# EAGLE design DMTV_SD (EAGLE 9.5.1)

## Sheet 1 of 4
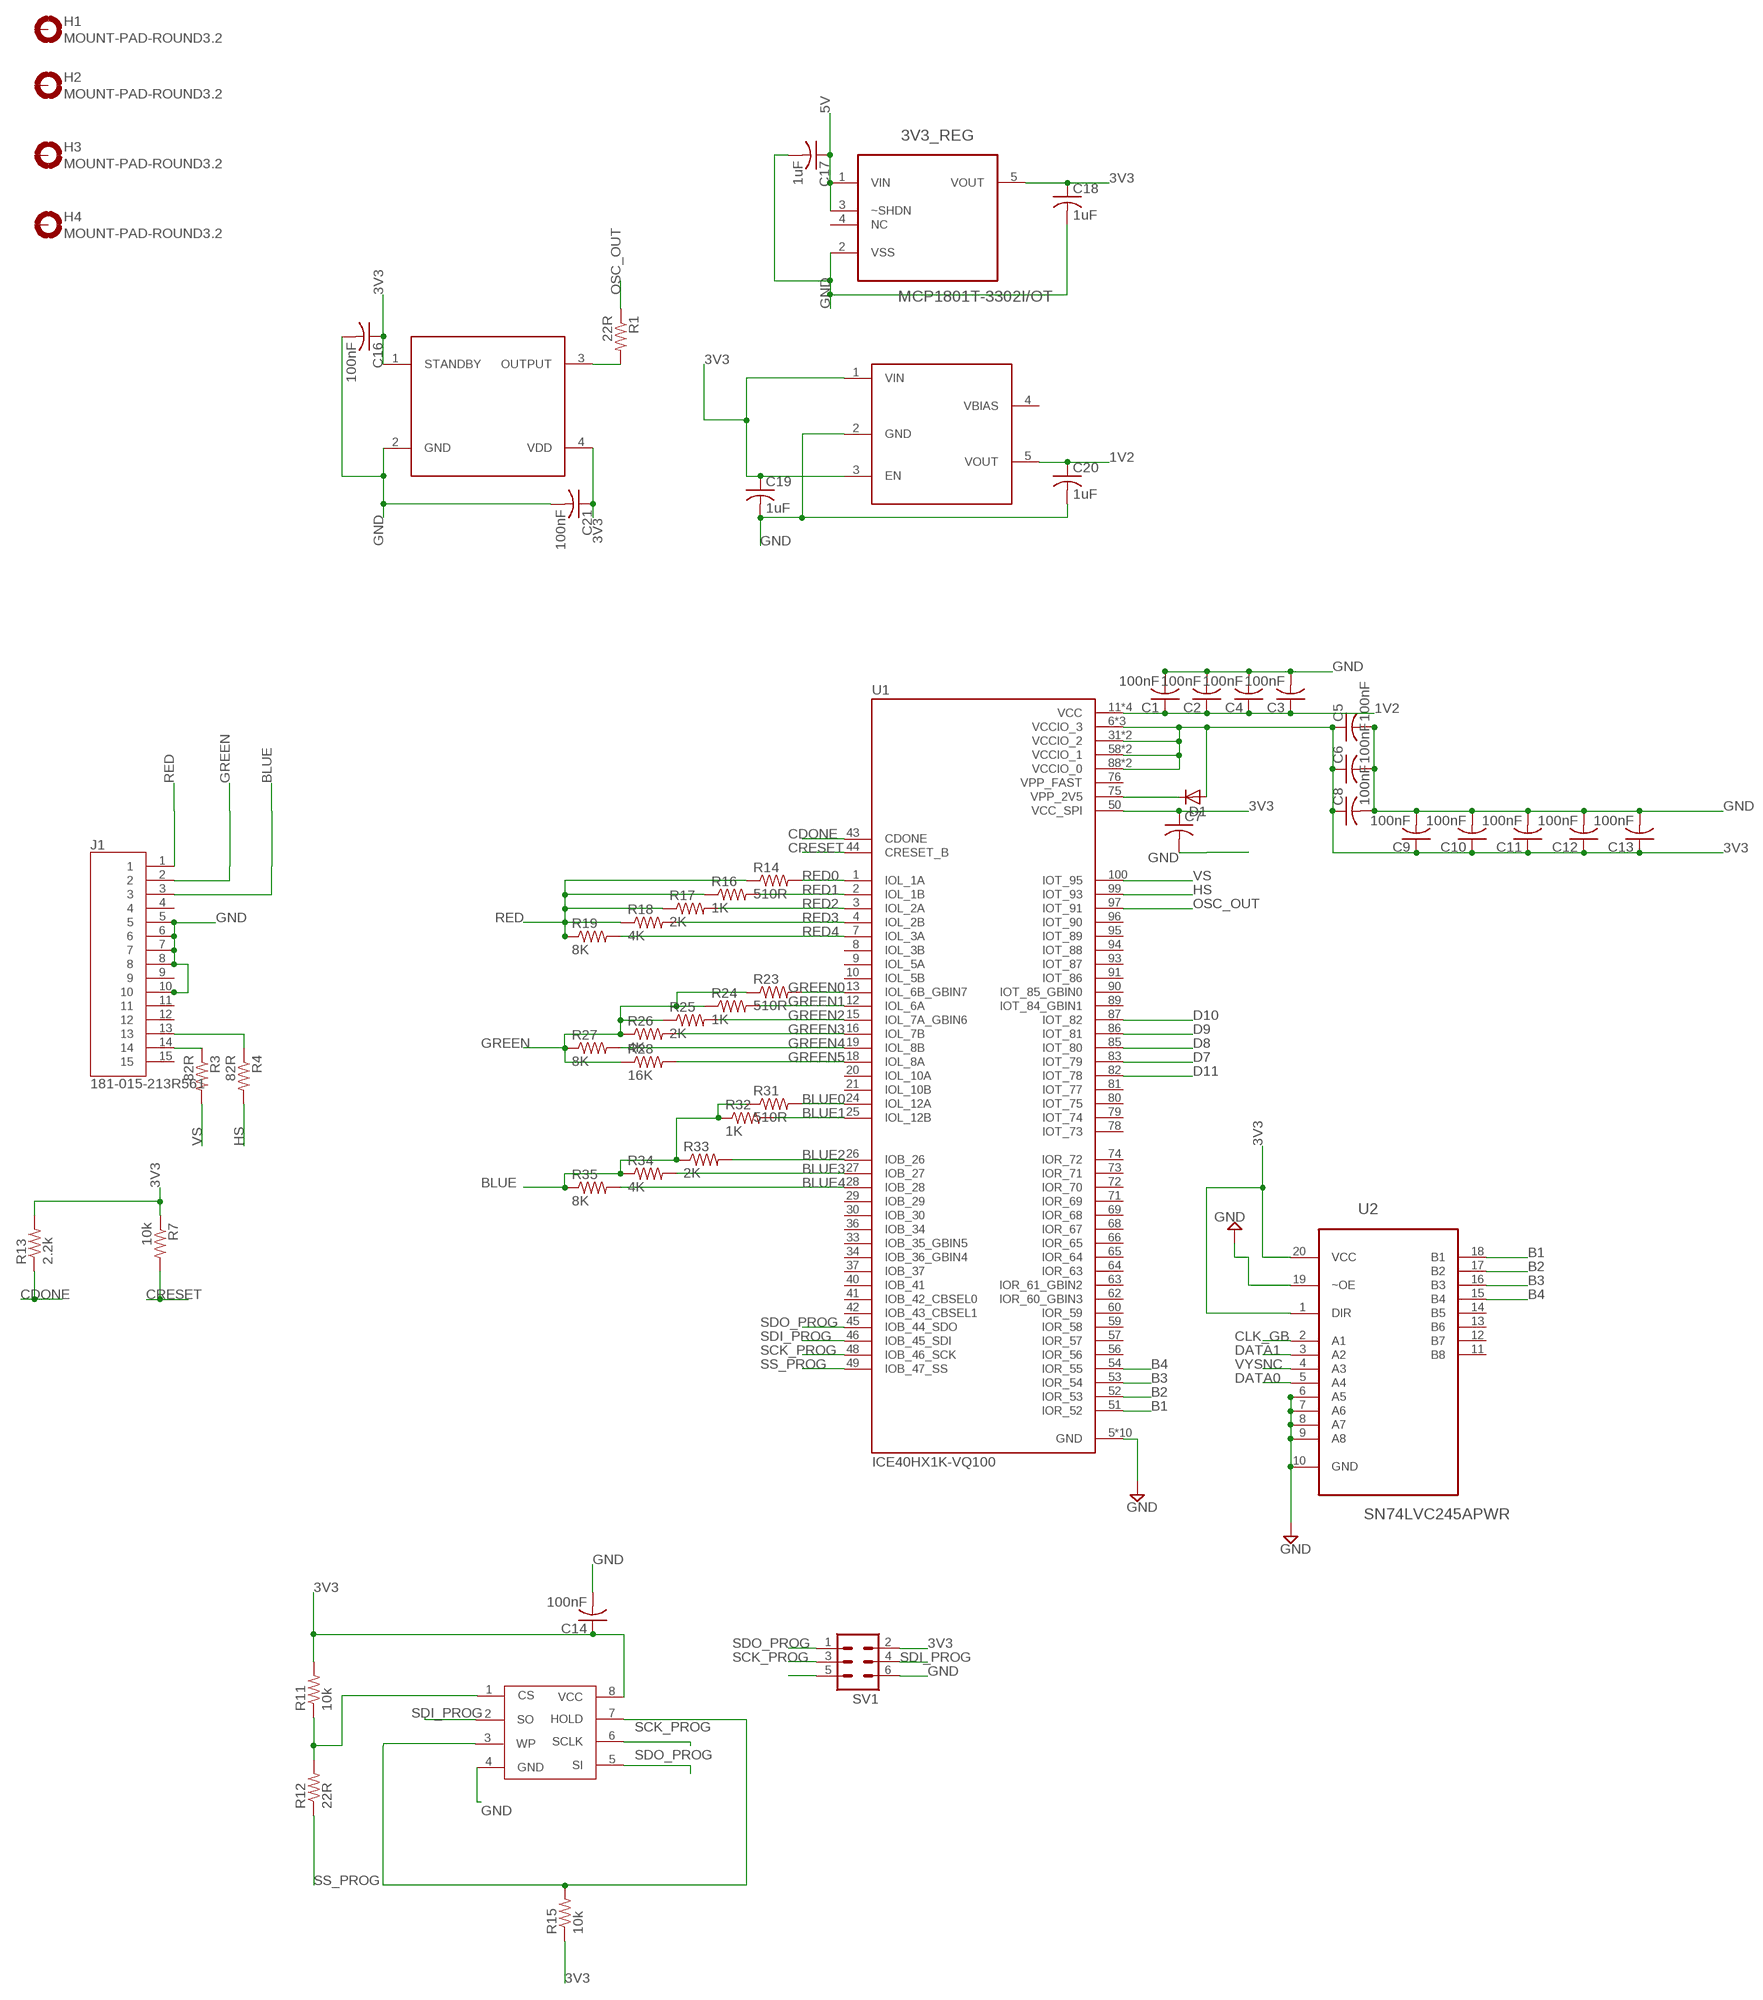
[diagram p0: schematic, sheet 1]

### Parts
3V3_REG  MCP1801T-3302I/OT  [SOT95P270X145-5N]
C1  100nF  C-USC0603  [C0603]
C2  100nF  C-USC0603  [C0603]
C3  100nF  C-USC0603  [C0603]
C4  100nF  C-USC0603  [C0603]
C5  100nF  C-USC0603  [C0603]
C6  100nF  C-USC0603  [C0603]
C7  C-USC0603  [C0603]
C8  100nF  C-USC0603  [C0603]
C9  100nF  C-USC0603  [C0603]
C10  100nF  C-USC0603  [C0603]
C11  100nF  C-USC0603  [C0603]
C12  100nF  C-USC0603  [C0603]
C13  100nF  C-USC0603  [C0603]
C14  100nF  C-USC0603  [C0603]
C16  100nF  C-USC0603  [C0603]
C17  1uF  C-USC0805  [C0805]
C18  1uF  C-USC0805  [C0805]
C19  1uF  C-USC0805  [C0805]
C20  1uF  C-USC0805  [C0805]
C21  100nF  C-USC0603  [C0603]
D1  D-SOD123  [SOD123]
H1  MOUNT-PAD-ROUND3.2  [3,2-PAD]
H2  MOUNT-PAD-ROUND3.2  [3,2-PAD]
H3  MOUNT-PAD-ROUND3.2  [3,2-PAD]
H4  MOUNT-PAD-ROUND3.2  [3,2-PAD]
J1  181-015-213R561  [NORCOMP_181-015-213R561]
R1  22R  R-US_R0603  [R0603]
R3  82R  R-US_R0603  [R0603]
R4  82R  R-US_R0603  [R0603]
R7  10k  R-US_R0603  [R0603]
R11  10k  R-US_R0603  [R0603]
R12  22R  R-US_R0603  [R0603]
R13  2.2k  R-US_R0603  [R0603]
R14  510R  R-US_R0603  [R0603]
R15  10k  R-US_R0603  [R0603]
R16  1K  R-US_R0603  [R0603]
R17  2K  R-US_R0603  [R0603]
R18  4K  R-US_R0603  [R0603]
R19  8K  R-US_R0603  [R0603]
R23  510R  R-US_R0603  [R0603]
R24  1K  R-US_R0603  [R0603]
R25  2K  R-US_R0603  [R0603]
R26  4K  R-US_R0603  [R0603]
R27  8K  R-US_R0603  [R0603]
R28  16K  R-US_R0603  [R0603]
R31  510R  R-US_R0603  [R0603]
R32  1K  R-US_R0603  [R0603]
R33  2K  R-US_R0603  [R0603]
R34  4K  R-US_R0603  [R0603]
R35  8K  R-US_R0603  [R0603]
SV1  MA03-2  [MA03-2]
U1  ICE40HX1K-VQ100  [QFP50P1600X1600X120-100N]
U2  SN74LVC245APWR  [SOP65P640X120-20N]
U$1  SIT8008BI-13-18E-25.175000G  XTAL_ASDM1-25.000MHZ-LC-T  [XTAL_ASDM1-25.000MHZ-LC-T]
U$2  TLV70012DDCR  SOT95P280X100-5N  [SOT95P280X100-5N]
U$5  MX25L1006EMI-10G  [SOIC-8]

### Nets
1V2: C1.1 C2.1 C3.1 C4.1 C20.1 U1.11(VCC) U1.35(VCC) U1.61(VCC) U1.77(VCC) U$2.5(VOUT)
3V3: 3V3_REG.5(VOUT) C5.1 C6.1 C7.1 C8.1 C9.1 C10.1 C11.1 C12.1 C13.1 C14.1 C16.1 C18.1 C19.1 C21.1 D1.2(A) R7.1 R11.2 R13.2 R15.1 SV1.2 U1.6(VCCIO_3) U1.14(VCCIO_3) U1.22(VCCIO_3) U1.31(VCCIO_2) U1.38(VCCIO_2) U1.50(VCC_SPI) U1.58(VCCIO_1) U1.67(VCCIO_1) U1.88(VCCIO_0) U1.92(VCCIO_0) U2.1(DIR) U2.20(VCC) U$1.1(STANDBY) U$1.4(VDD) U$2.1(VIN) U$2.3(EN) U$5.8(VCC)
5V: 3V3_REG.1(VIN) 3V3_REG.3(~SHDN) C17.1 ; also sheet 2,4
B1: U1.51(IOR_52) U2.18(B1)
B2: U1.52(IOR_53) U2.17(B2)
B3: U1.53(IOR_54) U2.16(B3)
B4: U1.54(IOR_55) U2.15(B4)
BLUE: J1.3 R31.1 R32.1 R33.1 R34.1 R35.1
BLUE0: R31.2 U1.24(IOL_12A)
BLUE1: R32.2 U1.25(IOL_12B)
BLUE2: R33.2 U1.26(IOB_26)
BLUE3: R34.2 U1.27(IOB_27)
BLUE4: R35.2 U1.28(IOB_28)
CDONE: R13.1 U1.43(CDONE)
CLK_GB: U2.2(A1) ; also sheet 4
CRESET: R7.2 U1.44(CRESET_B)
D7: U1.83(IOT_79) ; also sheet 2
D8: U1.85(IOT_80) ; also sheet 2
D9: U1.86(IOT_81) ; also sheet 2
D10: U1.87(IOT_82) ; also sheet 2
D11: U1.82(IOT_78) ; also sheet 2
DATA0: U2.5(A4) ; also sheet 4
DATA1: U2.3(A2) ; also sheet 4
GND: 3V3_REG.2(VSS) C1.2 C2.2 C3.2 C4.2 C5.2 C6.2 C7.2 C8.2 C9.2 C10.2 C11.2 C12.2 C13.2 C14.2 C16.2 C17.2 C18.2 C19.2 C20.2 C21.2 J1.5 J1.6 J1.7 J1.8 J1.10 SV1.6 U1.5(GND) U1.17(GND) U1.23(GND) U1.32(GND) U1.39(GND) U1.47(GND) U1.55(GND) U1.70(GND) U1.84(GND) U1.98(GND) U2.6(A5) U2.7(A6) U2.8(A7) U2.9(A8) U2.10(GND) U2.19(~OE) U$1.2(GND) U$2.2(GND) U$5.4(GND) ; also sheet 2,3,4
GREEN: J1.2 R23.1 R24.1 R25.1 R26.1 R27.1 R28.1
GREEN0: R23.2 U1.13(IOL_6B_GBIN7)
GREEN1: R24.2 U1.12(IOL_6A)
GREEN2: R25.2 U1.15(IOL_7A_GBIN6)
GREEN3: R26.2 U1.16(IOL_7B)
GREEN4: R27.2 U1.19(IOL_8B)
GREEN5: R28.2 U1.18(IOL_8A)
HS: R4.2 U1.99(IOT_93)
N$2: R1.2 U$1.3(OUTPUT)
N$6: J1.14 R3.1
N$7: D1.1(C) U1.75(VPP_2V5)
N$8: R11.1 R12.2 U$5.1(CS)
N$9: J1.13 R4.1
N$13: SV1.5
N$15: R15.2 U$5.3(WP) U$5.7(HOLD)
OSC_OUT: R1.1 U1.97(IOT_91)
RED: J1.1 R14.1 R16.1 R17.1 R18.1 R19.1
RED0: R14.2 U1.1(IOL_1A)
RED1: R16.2 U1.2(IOL_1B)
RED2: R17.2 U1.3(IOL_2A)
RED3: R18.2 U1.4(IOL_2B)
RED4: R19.2 U1.7(IOL_3A)
SCK_PROG: SV1.3 U1.48(IOB_46_SCK) U$5.6(SCLK)
SDI_PROG: SV1.4 U1.46(IOB_45_SDI) U$5.2(SO)
SDO_PROG: SV1.1 U1.45(IOB_44_SDO) U$5.5(SI)
SS_PROG: R12.1 U1.49(IOB_47_SS)
VS: R3.2 U1.100(IOT_95)
VYSNC: U2.4(A3) ; also sheet 4
Unconnected: 3V3_REG.4(NC) H1.B3,2(MOUNT) H2.B3,2(MOUNT) H3.B3,2(MOUNT) H4.B3,2(MOUNT) J1.4 J1.9 J1.11 J1.12 J1.15 U1.8(IOL_3B) U1.9(IOL_5A) U1.10(IOL_5B) U1.20(IOL_10A) U1.21(IOL_10B) U1.29(IOB_29) U1.30(IOB_30) U1.33(IOB_35_GBIN5) U1.34(IOB_36_GBIN4) U1.36(IOB_34) U1.37(IOB_37) U1.40(IOB_41) U1.41(IOB_42_CBSEL0) U1.42(IOB_43_CBSEL1) U1.56(IOR_56) U1.57(IOR_57) U1.59(IOR_58) U1.60(IOR_59) U1.62(IOR_60_GBIN3) U1.63(IOR_61_GBIN2) U1.64(IOR_63) U1.65(IOR_64) U1.66(IOR_65) U1.68(IOR_67) U1.69(IOR_68) U1.71(IOR_69) U1.72(IOR_70) U1.73(IOR_71) U1.74(IOR_72) U1.78(IOT_73) U1.79(IOT_74) U1.80(IOT_75) U1.81(IOT_77) U1.89(IOT_84_GBIN1) U1.90(IOT_85_GBIN0) U1.91(IOT_86) U1.93(IOT_87) U1.94(IOT_88) U1.95(IOT_89) U1.96(IOT_90) U2.11(B8) U2.12(B7) U2.13(B6) U2.14(B5) U$2.4(VBIAS)

## Sheet 2 of 4
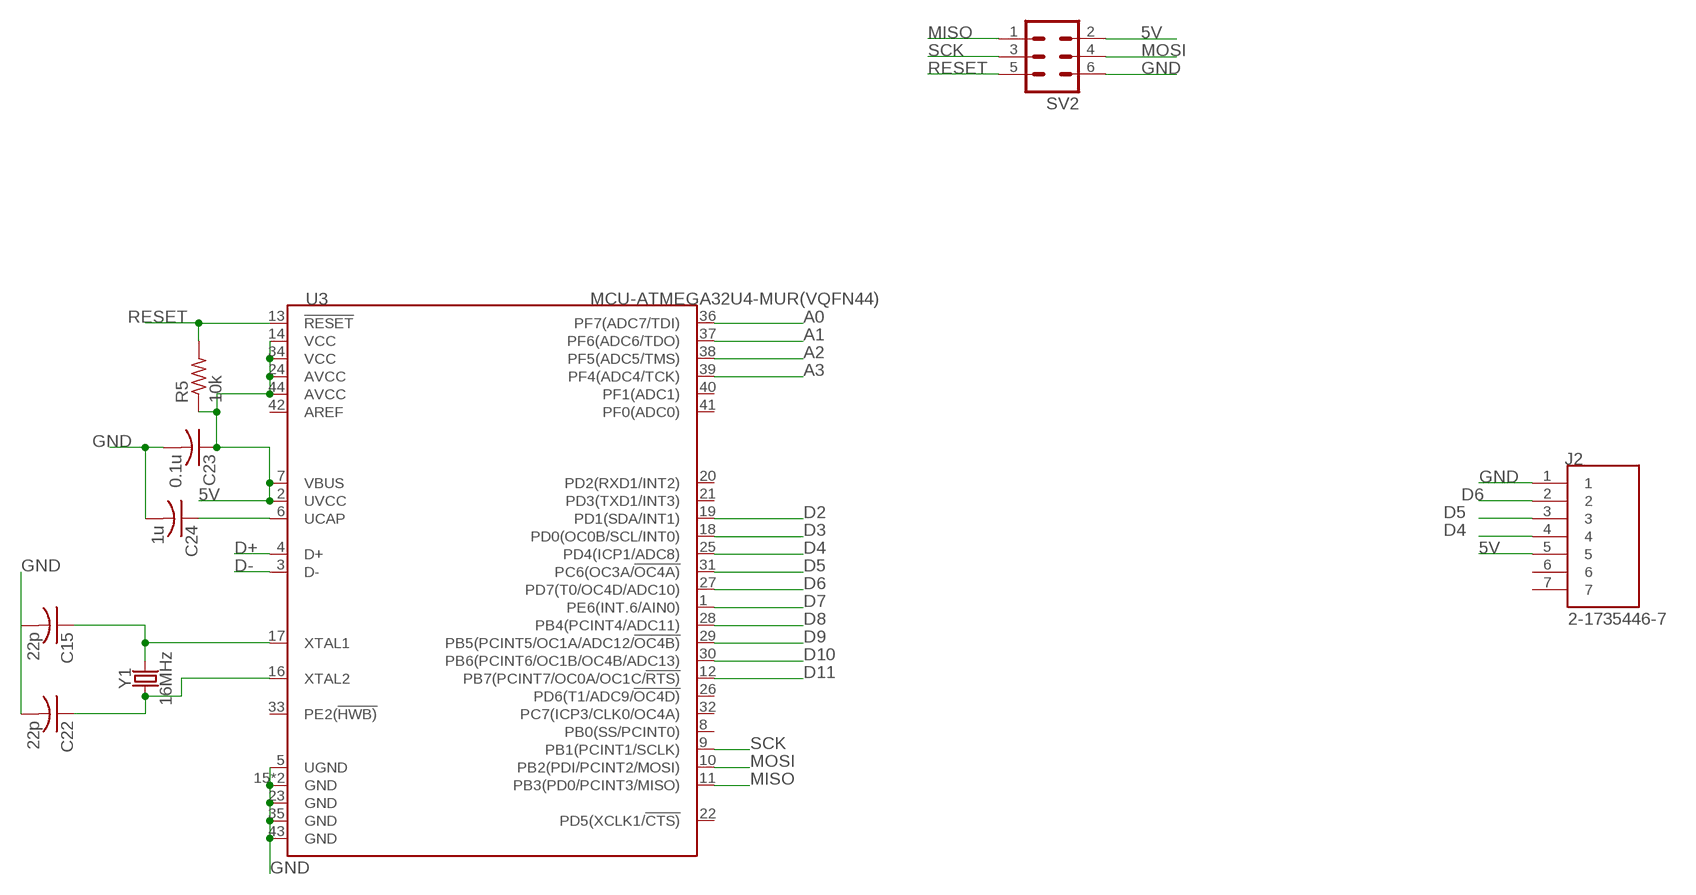
[diagram p1: schematic, sheet 2]

### Parts
C15  22p  C-USC0805  [C0805]
C22  22p  C-USC0805  [C0805]
C23  0.1u  C-USC0805  [C0805]
C24  1u  C-USC0805  [C0805]
J2  2-1735446-7  [TE_2-1735446-7]
R5  10k  R-US_R0805  [R0805]
SV2  MA03-2  [MA03-2]
U3  MCU-ATMEGA32U4-MUR(VQFN44)  [QFN44G-0.5-7X7MM]
Y1  16MHz  CRYSTAL-16MHZSMD-5X3.2  [CRYSTAL-SMD-5X3.2-4PAD]

### Nets
5V: C23.1 J2.5 R5.1 SV2.2 U3.2(UVCC) U3.7(VBUS) U3.14(VCC) U3.24(AVCC) U3.34(VCC) U3.44(AVCC) ; also sheet 1,4
A0: U3.36(PF7(ADC7/TDI)) ; also sheet 4
A1: U3.37(PF6(ADC6/TDO)) ; also sheet 4
A2: U3.38(PF5(ADC5/TMS)) ; also sheet 4
A3: U3.39(PF4(ADC4/TCK)) ; also sheet 4
D2: U3.19(PD1(SDA/INT1)) ; also sheet 4
D3: U3.18(PD0(OC0B/SCL/INT0)) ; also sheet 4
D4: J2.4 U3.25(PD4(ICP1/ADC8))
D5: J2.3 U3.31(PC6(OC3A/!OC4A))
D6: J2.2 U3.27(PD7(T0/OC4D/ADC10))
D7: U3.1(PE6(INT.6/AIN0)) ; also sheet 1
D8: U3.28(PB4(PCINT4/ADC11)) ; also sheet 1
D9: U3.29(PB5(PCINT5/OC1A/ADC12/!OC4B)) ; also sheet 1
D10: U3.30(PB6(PCINT6/OC1B/OC4B/ADC13)) ; also sheet 1
D11: U3.12(PB7(PCINT7/OC0A/OC1C/!RTS)) ; also sheet 1
D+: U3.4(D+)
D-: U3.3(D-)
GND: C15.2 C22.2 C23.2 C24.2 J2.1 SV2.6 U3.5(UGND) U3.15(GND) U3.23(GND) U3.35(GND) U3.43(GND) U3.TAB(GND) ; also sheet 1,3,4
MISO: SV2.1 U3.11(PB3(PD0/PCINT3/MISO))
MOSI: SV2.4 U3.10(PB2(PDI/PCINT2/MOSI))
N$1: C15.1 U3.17(XTAL1) Y1.3
N$3: C22.1 U3.16(XTAL2) Y1.1
N$4: C24.1 U3.6(UCAP)
RESET: R5.2 SV2.5 U3.13(!RESET)
SCK: SV2.3 U3.9(PB1(PCINT1/SCLK))
Unconnected: J2.6 J2.7 U3.8(PB0(SS/PCINT0)) U3.20(PD2(RXD1/INT2)) U3.21(PD3(TXD1/INT3)) U3.22(PD5(XCLK1/!CTS)) U3.26(PD6(T1/ADC9/!OC4D)) U3.32(PC7(ICP3/CLK0/OC4A)) U3.33(PE2(!HWB)) U3.40(PF1(ADC1)) U3.41(PF0(ADC0)) U3.42(AREF)

## Sheet 3 of 4
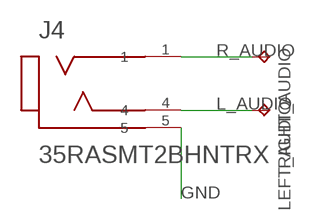
[diagram p2: schematic, sheet 3]

### Parts
J4  35RASMT2BHNTRX  [SWITCHCRAFT_35RASMT2BHNTRX]
LEFT_AUDIO  TPB2,54  [B2,54]
RIGHT_AUDIO  TPB2,54  [B2,54]

### Nets
GND: J4.5 ; also sheet 1,2,4
L_AUDIO: J4.4 LEFT_AUDIO.TP
R_AUDIO: J4.1 RIGHT_AUDIO.TP

## Sheet 4 of 4
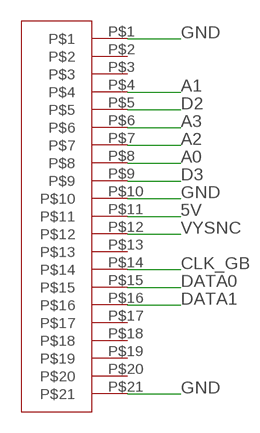
[diagram p3: schematic, sheet 4]

### Parts
U$6  52808-21700520452145  [0520452145]

### Nets
5V: U$6.P$11 ; also sheet 1,2
A0: U$6.P$8 ; also sheet 2
A1: U$6.P$4 ; also sheet 2
A2: U$6.P$7 ; also sheet 2
A3: U$6.P$6 ; also sheet 2
CLK_GB: U$6.P$14 ; also sheet 1
D2: U$6.P$5 ; also sheet 2
D3: U$6.P$9 ; also sheet 2
DATA0: U$6.P$15 ; also sheet 1
DATA1: U$6.P$16 ; also sheet 1
GND: U$6.P$1 U$6.P$10 U$6.P$21 ; also sheet 1,2,3
VYSNC: U$6.P$12 ; also sheet 1
Unconnected: U$6.P$2 U$6.P$3 U$6.P$13 U$6.P$17 U$6.P$18 U$6.P$19 U$6.P$20

## Power pins joined to a net without a drawn wire
VPP_FAST: U1.76(VPP_FAST)

## Library data of the parts
3V3_REG = MCP1801T-3302I_OT:MCP1801T-3302I/OT: Low Quiescent Current LDO; DESCRIPTION: Ic, Linear Regulator; Max. Input, 10v; Output, 3.3v; 150ma; Accuracy, 0.4%; Sot23-5; DIGI-KEY_PART_NUMBER: MCP1801T-3302I/OTCT-ND; DIGI-KEY_PURCHASE_URL: https://www.digikey.com/product-detail/en/microchip-technology/MCP1801T-3302I-OT/MCP1801T-3302I-OTCT-ND/1979868?utm_source=snapeda&utm_medium=aggregator&utm_campaign=symbol; MF: Microchip; MP: MCP1801T-3302I/OT; PACKAGE: SOT-23-5 Microchip
C1-C24 = rcl:C-US: CAPACITOR, American symbol; SPICEPREFIX: C
D1 = semicon-smd-ipc:D-: DIODE unfilled
H1-H4 = holes:MOUNT-PAD-ROUND: MOUNTING PAD, round
J1 = 181-015-213R561:181-015-213R561: 181 Series 15 Position Female Receptacle Right Angle D-Sub Connector; AVAILABILITY: Unavailable; DESCRIPTION: 181 Series 15 Position Female Receptacle Right Angle D-Sub Connector; MF: NorComp Inc.; MP: 181-015-213R561; PACKAGE: None; PRICE: None
J2 = 2-1735446-7_nesCont:2-1735446-7; AVAILABILITY: Unavailable; CENTERLINE_PITCH: 2 mm[.079 in]; COMMENT: 2-1735446-7; DESCRIPTION: 2MM PITCH HPI POST HEADER, VERTICAL, 7P; EU_ROHS_COMPLIANCE: Compliant; MF: TE Connectivity; MP: 2-1735446-7; NUMBER_OF_POSITIONS: 7; PACKAGE: None; PRICE: None; PRODUCT_TYPE: Connector; TE_PURCHASE_URL: https://www.te.com/usa-en/product-2-1735446-7.html?te_bu=Cor&te_type=disp&te_campaign=seda_glo_cor-seda-global-disp-prtnr-fy19-seda-model-bom-cta_sma-317_1&elqCampaignId=32493
J4 = 35RASMT2BHNTRX_3.5mmJack:35RASMT2BHNTRX: Conn 3.5MM Stereo Jack F 3 POS Solder RA SMD 3 Terminal 1 Port T/R; AVAILABILITY: Unavailable; DESCRIPTION: Conn 3.5MM Stereo Jack F 3 POS Solder RA SMD 3 Terminal 1 Port T/R; MF: Switchcraft; MP: 35RASMT2BHNTRX; PACKAGE: None; PRICE: None
LEFT_AUDIO RIGHT_AUDIO = testpad:TP: Test pad
R1 R3 R4 R7 R14 R16-R19 R23-R28 R31-R35 = resistor:R-US_: RESISTOR, American symbol
R5 R11-R13 R15 = rcl:R-US_: RESISTOR, American symbol; SPICEPREFIX: R
SV1 SV2 = con-lstb:MA03-2: PIN HEADER; OC_FARNELL: unknown; OC_NEWARK: unknown
U1 = ICE40HX1K-VQ100:ICE40HX1K-VQ100: HX Series 1280 LUTs 95 I/O 64 kBit RAM 1.2 V Surface Mount FPGA - VQFP-100; DESCRIPTION: HX Series 1280 LUTs 95 I/O 64 kBit RAM 1.2 V Surface Mount FPGA - VQFP-100; DIGI-KEY_PART_NUMBER: 220-1567-ND; DIGI-KEY_PURCHASE_URL: https://www.digikey.com/product-detail/en/lattice-semiconductor-corporation/ICE40HX1K-VQ100/220-1567-ND/3083577?utm_source=snapeda&utm_medium=aggregator&utm_campaign=symbol; MF: Lattice Semiconductor; MP: ICE40HX1K-VQ100; PACKAGE: TQFP-100 Lattice Semiconductor
U2 = SN74LVC245APWR:SN74LVC245APWR: OCTAL BUS TRANSCEIVER WITH 3-STATE OUTPUTS; DESCRIPTION: Octal Bus Transceiver With 3-State Outputs 20-TSSOP -40 to 125; DIGI-KEY_PART_NUMBER: 296-1233-1-ND; DIGI-KEY_PURCHASE_URL: https://www.digikey.com/product-detail/en/texas-instruments/SN74LVC245APWR/296-1233-1-ND/276501?utm_source=snapeda&utm_medium=aggregator&utm_campaign=symbol; MF: Texas Instruments; MP: SN74LVC245APWR; PACKAGE: TSSOP-20 Texas Instruments
U3 = MCU-ATMEGA32U4-MUR_VQFN44_:MCU-ATMEGA32U4-MUR(VQFN44): 310010016; AVAILABILITY: Unavailable; DESCRIPTION: ATmega Series 32 KB Flash 2.5 KB SRAM 16 MHz 8-Bit Microcontroller - MLF/QFN-44; MF: Microchip; MP: ATMEGA32U4-MUR; PACKAGE: QFN-44 Microchip; PRICE: None
U$1 = XTAL_ASDM1-25.000MHZ-LC-T:XTAL_ASDM1-25.000MHZ-LC-T
U$2 = SOT95P280X100-5N:SOT95P280X100-5N
U$5 = MX25L1006EMI-10G:MX25L1006EMI-10G
U$6 = 0520452145:52808-2170
Y1 = SparkFun-Clocks (2019_02_28 07_43_24 UTC):CRYSTAL-16MHZ: 16MHz Crystal Digikey Example <http://www.digikey.com/product-search/en?keywords=535-9122-1-ND> Frequency: 16MHz Frequency Stability: ±50ppm Frequency Tolerance: ±20ppm Load Capacitance: 18pF SparkFun Products: Pro Micro -5V/16MHz <https://www.sparkfun.com/products/12640> SparkFun Serial Enabled LCD Kit <https://www.sparkfun.com/products/10097>; PROD_ID: XTAL-08218; SF_ID: COM-00094

## Board
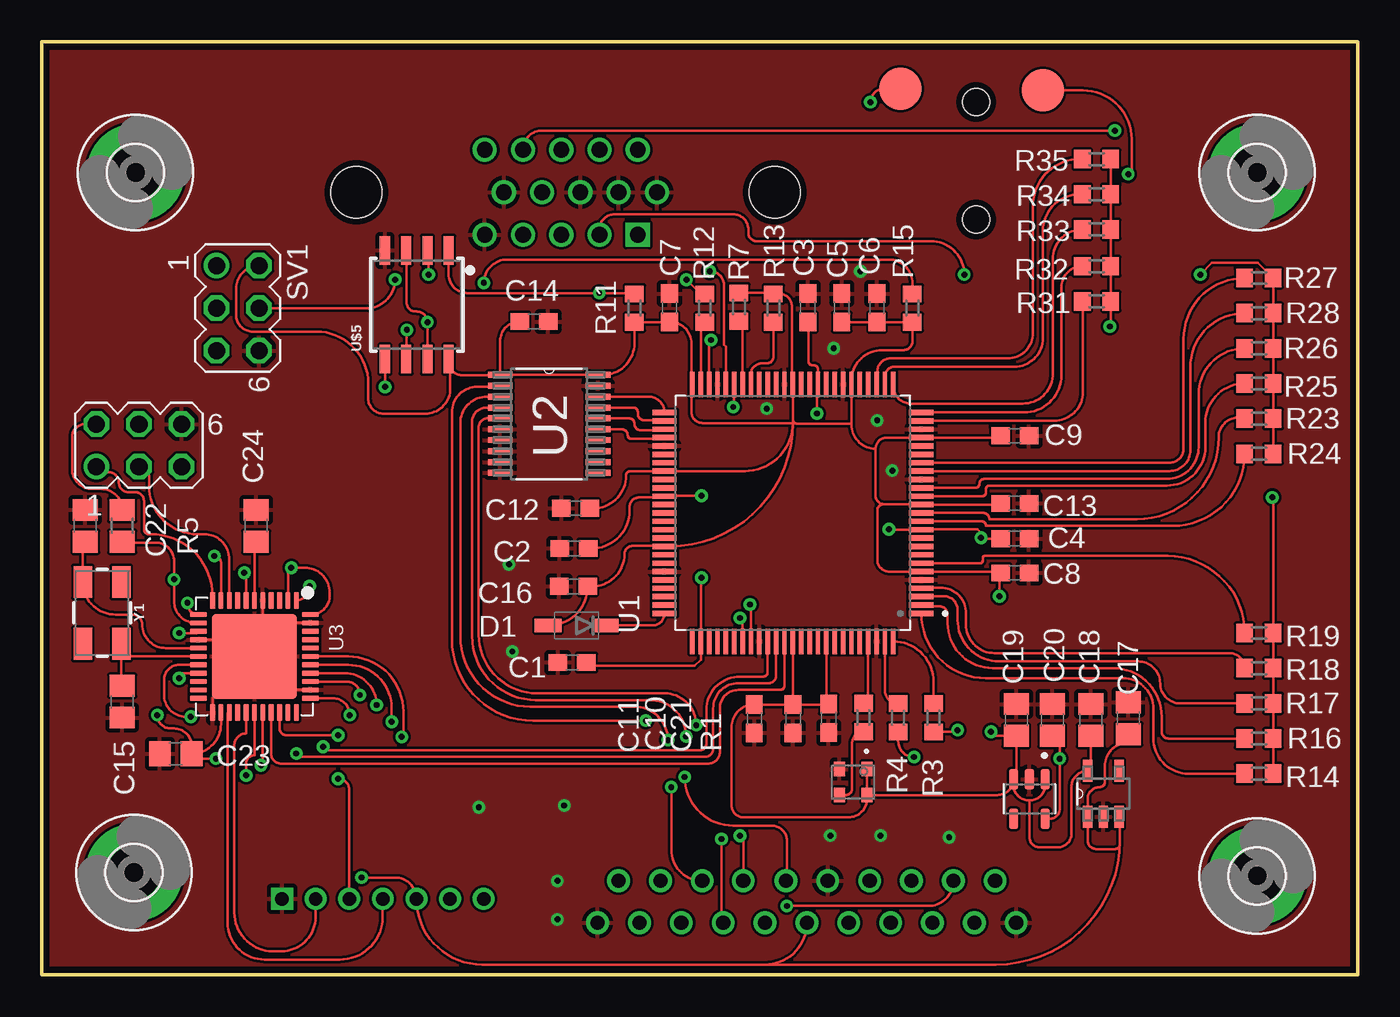
[diagram p4: board, top side]
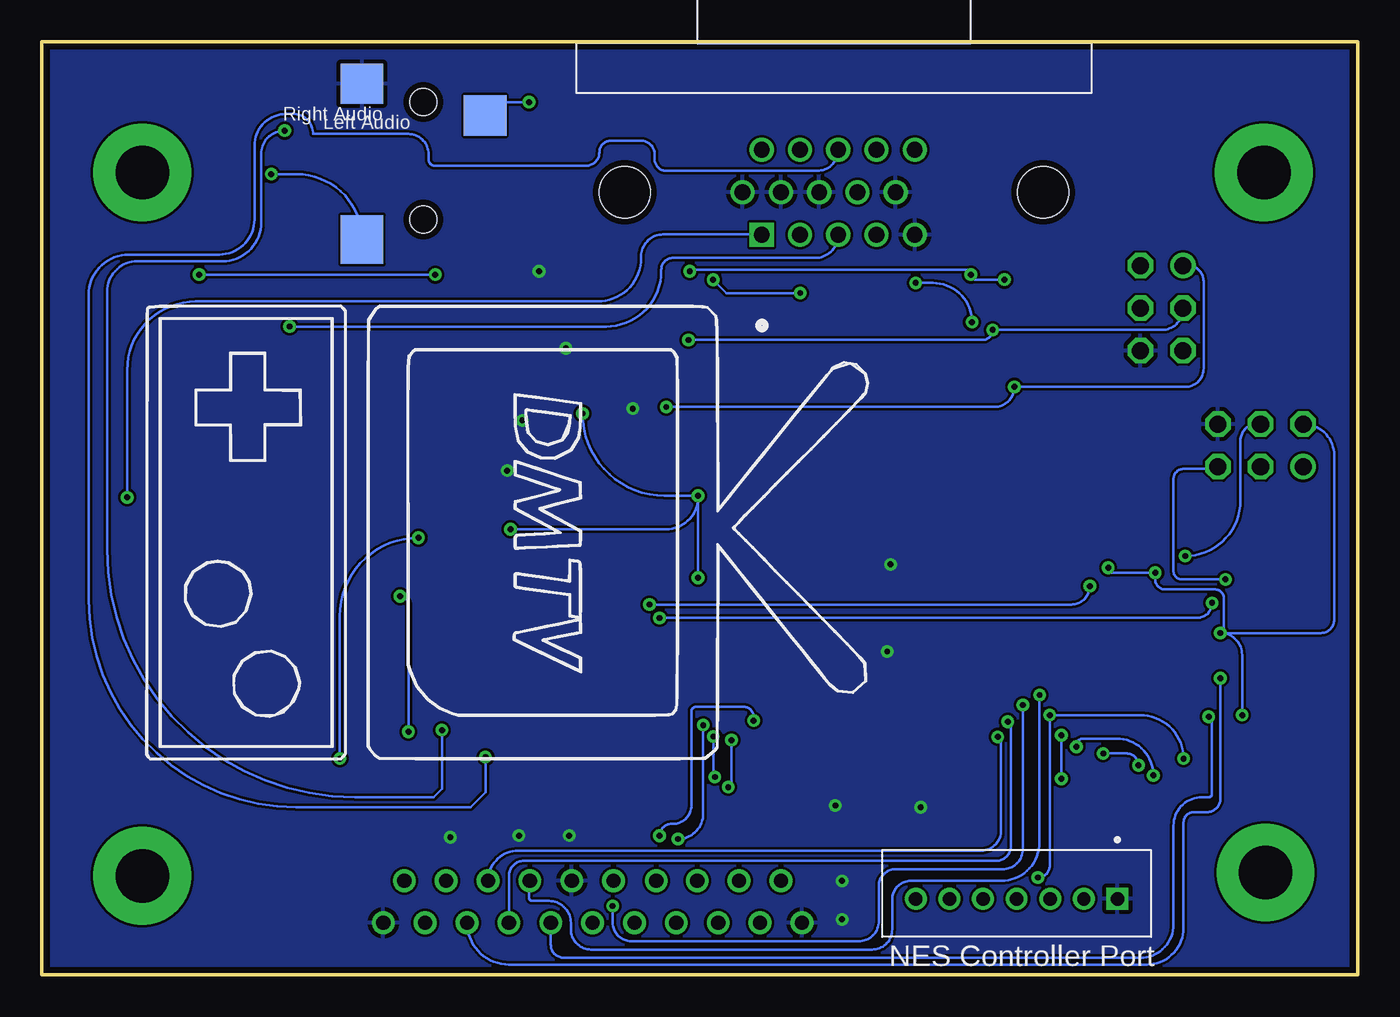
[diagram p5: board, bottom side, seen from below]

Size 78.6 x 55.7 mm. Coordinates in mm from the lower left corner, seen from the top.
Outline: 0,0 0,55.7 78.6,55.7 78.6,0 0,0
Copper layers (1*16): Top 0.035mm / dielectric 1.5mm / Bottom 0.035mm
Design rules "default *": minimum track width 6mil, minimum drill 0.35mm, track to track 6mil, track to pad 6mil, pad to pad 6mil, via to via 6mil, smd to smd 6mil, copper to edge 15mil, drill to drill 6mil, minimum pad ring 10mil, minimum via ring 8mil, stop-mask expansion 4mil, vias tented up to drill 36mil, thermal gap 10mil

### Footprints (pad centres in the part's own frame; a part is rotated, then mirrored left to right if it is on the bottom)
SOT95P270X145-5N = smd 1.321 x 0.559: 1 -1.372,0.94; 2 -1.372,0; 3 -1.372,-0.94; 4 1.372,-0.94; 5 1.372,0.94
C0603 = smd 1.1 x 1: 1 -0.85,0; 2 0.85,0
C0805 = smd 1.3 x 1.5: 1 -0.95,0; 2 0.95,0
SOD123 = smd 1.6 x 0.8: 1 -1.7,0; 2 1.7,0
3,2-PAD = drill 3.2 pad 5.842: B3,2 0,0
NORCOMP_181-015-213R561 = drill 0.94 square: 1 4.318,2.54 | drill 0.94: 2 2.032,2.54; 3 -0.254,2.54; 4 -2.54,2.54; 5 -4.826,2.54; 6 5.461,0; 7 3.175,0; 8 0.889,0; 9 -1.397,0; 10 -3.683,0; 11 4.318,-2.54; 12 2.032,-2.54; 13 -0.254,-2.54; 14 -2.54,-2.54; 15 -4.826,-2.54 | hole 3.048: 12.497,0; -12.497,0
TE_2-1735446-7 = drill 0.8 square: 1 6.02,0 | drill 0.8: 2 4.013,0; 3 2.007,0; 4 0,0; 5 -2.007,0; 6 -4.013,0; 7 -6.02,0
SWITCHCRAFT_35RASMT2BHNTRX = smd 2.4 x 2.55: 1 -2.7,3.675; 5 -4.6,-3.675 | smd 2.9 x 2.55: 4 4.7,-3.675 | hole 1.6: -3.5,0; 3.5,0
B2,54 = smd 2.54 x 2.54: TP 0,0
R0603 = smd 1 x 1.1: 1 -0.85,0; 2 0.85,0
R0805 = smd 1.3 x 1.5: 1 -0.95,0; 2 0.95,0
MA03-2 = drill 1.016: 1 -2.54,-1.27 | drill 1.016 octagon: 2 -2.54,1.27; 3 0,-1.27; 4 0,1.27; 5 2.54,-1.27; 6 2.54,1.27
QFP50P1600X1600X120-100N = smd 1.47 x 0.28: 1 -7.67,6; 2 -7.67,5.5; 3 -7.67,5; 4 -7.67,4.5; 5 -7.67,4; 6 -7.67,3.5; 7 -7.67,3; 8 -7.67,2.5; 9 -7.67,2; 10 -7.67,1.5; 11 -7.67,1; 12 -7.67,0.5; 13 -7.67,0; 14 -7.67,-0.5; 15 -7.67,-1; 16 -7.67,-1.5; 17 -7.67,-2; 18 -7.67,-2.5; 19 -7.67,-3; 20 -7.67,-3.5; 21 -7.67,-4; 22 -7.67,-4.5; 23 -7.67,-5; 24 -7.67,-5.5; 25 -7.67,-6; 51 7.67,-6; 52 7.67,-5.5; 53 7.67,-5; 54 7.67,-4.5; 55 7.67,-4; 56 7.67,-3.5; 57 7.67,-3; 58 7.67,-2.5; 59 7.67,-2; 60 7.67,-1.5; 61 7.67,-1; 62 7.67,-0.5; 63 7.67,0; 64 7.67,0.5; 65 7.67,1; 66 7.67,1.5; 67 7.67,2; 68 7.67,2.5; 69 7.67,3; 70 7.67,3.5; 71 7.67,4; 72 7.67,4.5; 73 7.67,5; 74 7.67,5.5; 75 7.67,6 | smd 0.28 x 1.47: 26 -6,-7.67; 27 -5.5,-7.67; 28 -5,-7.67; 29 -4.5,-7.67; 30 -4,-7.67; 31 -3.5,-7.67; 32 -3,-7.67; 33 -2.5,-7.67; 34 -2,-7.67; 35 -1.5,-7.67; 36 -1,-7.67; 37 -0.5,-7.67; 38 0,-7.67; 39 0.5,-7.67; 40 1,-7.67; 41 1.5,-7.67; 42 2,-7.67; 43 2.5,-7.67; 44 3,-7.67; 45 3.5,-7.67; 46 4,-7.67; 47 4.5,-7.67; 48 5,-7.67; 49 5.5,-7.67; 50 6,-7.67; 76 6,7.67; 77 5.5,7.67; 78 5,7.67; 79 4.5,7.67; 80 4,7.67; 81 3.5,7.67; 82 3,7.67; 83 2.5,7.67; 84 2,7.67; 85 1.5,7.67; 86 1,7.67; 87 0.5,7.67; 88 0,7.67; 89 -0.5,7.67; 90 -1,7.67; 91 -1.5,7.67; 92 -2,7.67; 93 -2.5,7.67; 94 -3,7.67; 95 -3.5,7.67; 96 -4,7.67; 97 -4.5,7.67; 98 -5,7.67; 99 -5.5,7.67; 100 -6,7.67
SOP65P640X120-20N = smd 1.473 x 0.356: 1 -2.921,2.921; 2 -2.921,2.286; 3 -2.921,1.626; 4 -2.921,0.965; 5 -2.921,0.33; 6 -2.921,-0.33; 7 -2.921,-0.965; 8 -2.921,-1.626; 9 -2.921,-2.286; 10 -2.921,-2.921; 11 2.921,-2.921; 12 2.921,-2.286; 13 2.921,-1.626; 14 2.921,-0.965; 15 2.921,-0.33; 16 2.921,0.33; 17 2.921,0.965; 18 2.921,1.626; 19 2.921,2.286; 20 2.921,2.921
QFN44G-0.5-7X7MM = smd 1 x 0.3: 1 -3.35,2.5; 2 -3.35,2; 3 -3.35,1.5; 4 -3.35,1; 5 -3.35,0.5; 6 -3.35,0; 7 -3.35,-0.5; 8 -3.35,-1; 9 -3.35,-1.5; 10 -3.35,-2; 11 -3.35,-2.5; 23 3.35,-2.5; 24 3.35,-2; 25 3.35,-1.5; 26 3.35,-1; 27 3.35,-0.5; 28 3.35,0; 29 3.35,0.5; 30 3.35,1; 31 3.35,1.5; 32 3.35,2; 33 3.35,2.5 | smd 0.3 x 1: 12 -2.5,-3.35; 13 -2,-3.35; 14 -1.5,-3.35; 15 -1,-3.35; 16 -0.5,-3.35; 17 0,-3.35; 18 0.5,-3.35; 19 1,-3.35; 20 1.5,-3.35; 21 2,-3.35; 22 2.5,-3.35; 34 2.5,3.35; 35 2,3.35; 36 1.5,3.35; 37 1,3.35; 38 0.5,3.35; 39 0,3.35; 40 -0.5,3.35; 41 -1,3.35; 42 -1.5,3.35; 43 -2,3.35; 44 -2.5,3.35 | smd 5.08 x 5.08: TAB 0,0
XTAL_ASDM1-25.000MHZ-LC-T = smd 0.85 x 0.65: 1 -0.775,0.825; 2 -0.775,-0.825; 3 0.775,-0.825; 4 0.775,0.825
SOT95P280X100-5N = smd 1.24 x 0.55: 1 -1.185,0.95; 2 -1.185,0; 3 -1.185,-0.95; 4 1.185,-0.95; 5 1.185,0.95
SOIC-8 = smd 0.61 x 1.702: 1 -1.905,-3.251; 2 -0.635,-3.251; 3 0.635,-3.251; 4 1.905,-3.251; 5 1.905,3.251; 6 0.635,3.251; 7 -0.635,3.251; 8 -1.905,3.251
0520452145 = drill 0.85: P$1 0,0; P$2 1.25,2.5; P$3 2.5,0; P$4 3.75,2.5; P$5 5,0; P$6 6.25,2.5; P$7 7.5,0; P$8 8.75,2.5; P$9 10,0; P$10 11.25,2.5; P$11 12.5,0; P$12 13.75,2.5; P$13 15,0; P$14 16.3,2.5; P$15 17.5,0; P$16 18.75,2.5; P$17 20,0; P$18 21.25,2.5; P$19 22.5,0; P$20 23.75,2.5; P$21 25,0
CRYSTAL-SMD-5X3.2-4PAD = smd 1.9 x 1.1: 1 -1.85,-1.15; 2 1.85,-1.15; 3 1.85,1.15; 4 -1.85,1.15

### Placement (x,y rotation side)
3V3_REG  63.41,10.8 90 top
C1  31.68,18.64 180 top
C2  31.78,25.45 180 top
C3  45.76,39.82 90 top
C4  58.12,26.03 0 top
C5  47.78,39.82 90 top
C6  49.89,39.82 90 top
C7  37.5,39.82 90 top
C8  58.12,23.99 0 top
C9  58.12,32.18 0 top
C10  44.87,15.28 270 top
C11  42.56,15.28 270 top
C12  31.88,27.85 180 top
C13  58.12,28.14 0 top
C14  29.4,39 0 top
C15  4.8,16.3 270 top
C16  31.76,23.19 180 top
C17  64.91,15.31 90 top
C18  62.66,15.21 90 top
C19  58.21,15.21 90 top
C20  60.36,15.21 90 top
C21  47,15.3 270 top
C22  2.6,26.8 90 top
C23  8,13.2 180 top
C24  12.8,26.8 90 top
D1  31.94,20.85 180 top
H1  5.6,47.9 0 top
H2  5.5,6.1 0 top
H3  72.6,5.9 0 top
H4  72.6,47.9 0 top
J1  31.28,46.72 180 bottom
J2  20.37,4.52 0 bottom
J4  55.8,48.6 270 bottom
LEFT_AUDIO  59.8,52.8 0 top
R1  49.09,15.36 270 top
R3  53.27,15.34 90 top
R4  51.15,15.34 90 top
R5  4.8,26.8 270 top
R7  41.64,39.86 270 top
R11  35.4,39.8 270 top
R12  39.6,39.8 90 top
R13  43.7,39.8 90 top
R14  72.7,12 180 top
R15  52,39.8 90 top
R16  72.7,14.1 180 top
R17  72.7,16.2 180 top
R18  72.7,18.3 180 top
R19  72.7,20.4 180 top
R23  72.7,33.2 180 top
R24  72.7,31.1 180 top
R25  72.7,35.3 180 top
R26  72.7,37.4 180 top
R27  72.7,41.6 180 top
R28  72.7,39.5 180 top
R31  63,40.2 180 top
R32  63,42.3 180 top
R33  63,44.5 180 top
R34  63,46.6 180 top
R35  63,48.7 180 top
RIGHT_AUDIO  51.3,52.9 0 top
SV1  11.7,39.8 270 top
SV2  5.8,31.6 0 top
U1  44.86,27.57 180 top
U2  30.3,32.89 0 top
U3  12.7,19 270 top
U$1  48.46,11.5 270 top
U$2  58.99,10.49 270 top
U$4  [DMTVPLS]  72.4,40 270 bottom
U$5  22.4,40 180 top
U$6  58.2,3.1 0 bottom
Y1  3.6,21.6 270 top

### Tracks (layer width: path | path; a pad name or v marks a point on that pad's centre or on a via)
1V2  (via drill 0.35)
  Top 0.152: C4.1 56.47,26.03 arc-90 56.2,26.3 arc90 56.1,26.4 | C3.1 arc-90 45.8,38.93 45.8,36.6 arc90 46,36.4 46.1,36.4 arc-90 46.36,36.14 U1.35 arc90 46.3,35.18 v46.3,33.51 | C2.1 32.85,25.45 arc90 35.1,27.7 35.1,27.9 arc-90 35.7,28.5 37.12,28.5 arc90 U1.61 arc-90 37.22,28.6 v39.4,28.6 | C20.1 arc-90 60.8,13.82 v60.8,12.9 | v60.8,12.9 60.8,12.6 | 60.8,12.6 60.8,9.9 arc-90 60.2,9.3 U$2.5 | C1.1 32.73,18.44 39,18.44 39.36,18.8 U1.77 39.36,23.66 arc-90 v39.4,23.7 | 60.8,12.6 v60.8,12.9 | v56.1,26.09 56.1,26.4 | v50.6,26.6 arc90 50.63,26.57 U1.11 arc-90 52.56,26.6 55.9,26.6 56.1,26.4
  Bottom 0.152: v60.8,12.9 60.8,21.39 arc90 v56.1,26.09 | v39.4,23.7 39.4,28.5 | 39.4,28.5 v39.4,28.6 41.39,28.6 arc90 v46.3,33.51 | v50.6,26.6 41.3,26.6 arc-90 39.4,28.5
3V3  (via drill 0.35)
  Top 0.152: C13.1 arc-90 57.2,28.07 U1.14 arc90 52.5,28.1 50.3,28.1 | C9.1 arc-90 57.16,32.07 U1.22 50.47,32.07 arc90 49.8,31.4 | C5.1 C6.1 51.98,38.97 arc-90 R15.1 52,37.8 arc-90 51.5,37.3 50.2,37.3 arc90 48.36,35.46 U1.31 48.36,32.9 | C7.1 37.53,38.97 | 37.53,38.97 arc-90 38.8,37.7 38.8,35.3 arc90 U1.50 arc90 38.8,35.18 38.8,33.6 arc90 39.46,32.94 44.86,32.94 | R11.2 35.5,38.95 | 35.5,38.95 37.51,38.95 arc90 37.53,38.97 | C12.1 32.95,27.85 arc90 34.9,29.8 arc-90 35.17,30.07 U1.58 41.99,30.07 arc90 44.86,32.94 | C10.1 C11.1 arc90 41.2,14.77 41.2,10.1 arc90 41.9,9.4 48.2,9.4 arc90 49.29,10.48 U$1.4 | C10.1 46.98,16.13 arc90 C21.1 arc-90 46.86,16.29 U1.92 | C10.1 U1.88 arc90 U1.88 | U$1.1 U$1.4 | U$2.3 arc-90 57.09,10.72 U$1.4 | U$2.3 arc90 58.21,11.85 C19.1 56.94,14.26 arc-90 v56.7,14.5 | U$2.1 59.94,11.34 arc-90 59,10.4 | 59,10.4 arc-106 U$2.3 | C18.1 62.66,12.36 arc-90 3V3_REG.5 arc90 61.5,11.2 61.5,8.4 arc-90 60.7,7.6 59.6,7.6 arc-90 59,8.2 59,10.4 | R7.1 43.64,40.71 arc-90 R13.2 44.05,40.65 arc-90 44.8,39.9 44.8,35.3 arc90 U1.38 44.86,33.14 | D1.2 30.27,20.85 arc90 C16.1 32.89,23.19 arc90 34.8,25.1 arc-90 35.3,25.6 37.16,25.6 arc-90 U1.67 37.49,25.57 arc90 44.86,32.94 | 27.5,35.81 U2.1 27.38,37.83 arc-90 C14.1 | 27.5,35.81 U2.20 33.51,35.81 arc90 35.4,37.7 35.4,38.85 arc-90 35.5,38.95 | U$5.8 24.3,36.59 | 24.3,36.59 arc90 25.1,35.8 27.49,35.8 arc90 27.5,35.81 | SV1.2 arc90 11.6,40.97 11.6,39.4 arc90 12.6,38.4 16.4,38.4 arc-90 19.5,35.3 19.5,34.4 arc90 20.4,33.5 22.9,33.5 arc90 24.4,35 24.4,36.5 arc90 24.3,36.59 | v57.2,22.6 57.2,23.92 arc-90 C8.1 arc90 57.19,24.07 U1.6 50.63,24.07 arc-90 49.9,24.8 49.9,27.7 arc-90 50.3,28.1
  Top 0.152: 49.8,31.4 49.8,28.6 arc90 50.3,28.1 | 48.36,32.9 48.36,32.84 arc90 49.8,31.4 | 44.86,33.14 arc90 45.1,32.9 48.36,32.9 | 44.86,33.14 44.86,32.94
  Bottom 0.152: v56.7,14.5 56.7,22.1 arc-90 v57.2,22.6
5V  (via drill 0.35)
  Top 0.152: 64.4,8 64.4,7.8 arc-90 64.1,7.5 63,7.5 arc-90 62.47,8.03 3V3_REG.1 62.47,10.47 arc-90 63.2,11.2 arc90 63.5,11.5 63.5,12.45 arc-90 64.91,13.86 C17.1 | 64.4,8 64.4,9.38 arc90 3V3_REG.3 | C23.1 arc90 10.7,14.95 U3.24 | U$6.P$11 arc-90 43.2,0.6 42.9,0.6 | 42.9,0.6 26.3,0.6 arc-90 J2.5 arc90 21.1,5.8 v19.1,5.8 | SV2.2 2.57,32.87 arc90 1.8,32.1 1.8,30.2 arc90 3,29 3.55,29 arc-90 R5.1 | 42.9,0.6 57,0.6 arc90 64.4,8 | U3.34 17.39,16.5 arc-90 v18.39,15.5 | v10.4,12.9 9.25,12.9 arc-90 C23.1 | C23.1 8.95,13.65 arc90 7.9,14.7 7.7,14.7 arc-90 v6.9,15.5 | v8.2,20.4 9.25,20.4 arc90 U3.14 | U3.7 12.2,23.89 arc90 v12.09,24 | U3.2 14.7,24.1 arc-90 v14.9,24.3 15.7,24.3 arc-90 17.2,22.8 17.2,22.65 arc-90 U3.44
  Bottom 0.152: v19.1,5.8 arc-90 18.39,6.51 v18.39,15.5 13,15.5 arc90 v10.4,12.9 | v6.9,15.5 6.9,19.1 arc-90 v8.2,20.4 | v8.2,20.4 2.2,20.4 arc-90 1.4,21.2 1.4,31.01 arc-90 SV2.2 | v8.2,20.4 arc-90 8,20.6 8,22.5 arc-90 8.5,23 11.5,23 arc90 12.09,23.59 v12.09,24 14.6,24 arc90 v14.9,24.3
A0  (via drill 0.35)
  Top 0.152: U3.36 18.2,17.5 arc-90 v19,16.7
  Bottom 0.152: v19,16.7 19,7.9 arc90 21.3,5.6 26.7,5.6 arc-90 27.8,4.5 27.8,2.7 arc90 29,1.5 45.8,1.5 arc90 47,2.7 47,3.1 arc-90 48.3,4.4 49.3,4.4 arc90 49.5,4.6 49.5,5.55 arc90 U$6.P$8
A1  (via drill 0.35)
  Top 0.152: U3.37 18.1,18 arc-90 v20,16.1 | v44.5,4.1 52.95,4.1 arc90 U$6.P$4
  Bottom 0.152: v20,16.1 20,7.5 arc90 21.2,6.3 27.6,6.3 arc-90 28.6,5.3 28.6,3.2 arc90 29.8,2 43.4,2 arc90 44.5,3.1 v44.5,4.1
A2  (via drill 0.35)
  Top 0.152: v20.9,15.1 20.9,15.9 arc90 18.3,18.5 U3.38
  Bottom 0.152: U$6.P$7 50.7,5.9 arc90 49.8,6.8 21.6,6.8 arc-90 20.7,7.7 20.7,14.9 arc-90 v20.9,15.1
A3  (via drill 0.35)
  Top 0.152: U3.39 18.3,19 arc-90 21.6,15.7 21.6,14.3 v21.5,14.2
  Bottom 0.152: U$6.P$6 arc90 50.15,7.4 22.5,7.4 arc-90 21.3,8.6 21.3,14 arc-90 v21.5,14.2
B1
  Top 0.152: U2.18 36.24,34.52 arc-90 U1.51
B2
  Top 0.152: U2.17 35.34,33.85 arc-90 35.6,33.6 35.6,33.5 arc90 36,33.1 37.16,33.1 arc-90 U1.52
B3
  Top 0.152: U2.16 35.08,33.22 arc-90 35.4,32.9 arc90 35.8,32.5 37.12,32.5 arc90 U1.53
B4
  Top 0.152: U2.15 34.64,32.56 arc-90 35,32.2 arc90 35.2,32 37.12,32 arc90 U1.54
BLUE  (via drill 0.35)
  Top 0.152: R35.1 R33.1 | R33.1 R31.1 | R31.1 63.85,38.75 arc-90 v63.8,38.7 | R34.1 R33.1 | R32.1 R31.1
  Bottom 0.152: v63.8,38.7 44.9,38.7 arc-90 41.6,42 41.6,42.1 arc90 40.9,42.8 32.41,42.8 arc-90 J1.3
BLUE0
  Top 0.152: U1.24 60.47,33.07 arc90 62.2,34.8 62.2,40.15 arc90 R31.2
BLUE1
  Top 0.152: U1.25 58.67,33.57 arc90 60.9,35.8 60.9,41.05 arc-90 R32.2
BLUE2
  Top 0.152: U1.26 50.86,35.14 arc90 51.9,34.1 58.6,34.1 arc90 60.4,35.9 60.4,42.75 arc-90 R33.2
BLUE3
  Top 0.152: R34.2 62,46.6 arc90 59.8,44.4 59.8,38 arc-90 58.1,36.3 50.9,36.3 arc90 50.4,35.8 50.4,35.28 arc-90 U1.27
BLUE4
  Top 0.152: R35.2 62,48.7 arc90 59.2,45.9 59.2,38.3 arc-90 57.7,36.8 50.7,36.8 arc90 49.9,36 49.9,35.28 arc-90 U1.28
CDONE
  Top 0.152: U1.43 42.36,35.86 arc-90 43,36.5 43.3,36.5 arc90 43.7,36.9 R13.1
CLK_GB  (via drill 0.35)
  Top 0.152: U$6.P$14 41.9,8.09 arc90 v41.7,8.29 | v36.08,15.17 29.33,15.17 arc-90 24.5,20 24.5,33.6 arc-90 26,35.1 27.3,35.1 arc90 U2.2
  Bottom 0.152: v41.7,8.29 arc90 40.99,9 40.9,9 arc-90 39.8,10.1 39.8,15.7 arc90 39.5,16 36.7,16 arc90 36.08,15.38 v36.08,15.17
CRESET
  Top 0.152: U1.44 41.86,38.79 arc90 R7.2
D2  (via drill 0.35)
  Top 0.152: U3.19 8.5,18 arc90 v8.2,17.7
  Bottom 0.152: v8.2,17.7 8.2,10.5 arc90 9,9.7 9.8,9.7 arc-90 10.4,9.1 10.4,2.8 arc90 12.6,0.6 50.7,0.6 arc90 U$6.P$5
D3  (via drill 0.35)
  Top 0.152: v8.9,15.4 8.6,15.4 arc-90 7.3,16.7 7.3,17.6 arc-90 8.2,18.5 U3.18
  Bottom 0.152: U$6.P$9 48.2,1.8 arc-90 47.4,1 13,1 arc-90 11,3 11,8.9 arc90 9.3,10.6 8.9,10.6 arc-90 8.7,10.8 8.7,15.2 arc-90 v8.9,15.4
D4
  Top 0.152: U3.25 arc90 11.1,15.55 11.1,3.1 arc90 13.3,0.9 17.8,0.9 arc90 20.37,3.47 J2.4
D5  (via drill 0.35)
  Top 0.152: U3.31 14.2,14.7 arc90 14.6,14.3 v17.7,14.3 | v17.7,11.7 arc-90 18.36,11.04 J2.3
  Bottom 0.152: v17.7,14.3 v17.7,11.7
D6
  Top 0.152: U3.27 12.2,14.4 arc90 11.5,13.7 11.5,3.7 arc90 13.8,1.4 14.3,1.4 arc90 16.36,3.46 J2.2
D7  (via drill 0.35)
  Top 0.152: U1.83 42.36,22.04 arc90 v42.3,22.1 | v16,23.2 16,23.15 arc-90 U3.1
  Bottom 0.152: v42.3,22.1 17.1,22.1 arc-90 v16,23.2
D8  (via drill 0.35)
  Top 0.152: U1.85 43.36,18.06 arc-90 43.1,17.8 41.7,17.8 arc90 39.7,15.8 39.7,13.8 arc-90 39.3,13.4 17.01,13.4 arc-90 v16.8,13.61 | v12.2,11.9 12.2,12.6 arc-90 12.7,13.1 U3.28
  Bottom 0.152: v16.8,13.61 16.8,13.7 arc90 16.4,14.1 14.4,14.1 arc90 v12.2,11.9
D9  (via drill 0.35)
  Top 0.152: U1.86 43.86,17.86 arc-90 43.4,17.4 41.6,17.4 arc90 40.1,15.9 40.1,13.5 arc-90 39.6,13 15.41,13 arc-90 v15.2,13.21 | U3.29 arc90 U3.29 13.19,12.6 v13.09,12.5
  Bottom 0.152: v15.2,13.21 13.8,13.21 arc90 v13.09,12.5
D10
  Top 0.152: U1.87 44.36,17.26 arc-90 44.1,17 41.6,17 arc90 40.5,15.9 40.5,13.3 arc-90 39.8,12.6 14.3,12.6 arc-90 13.7,13.2 U3.30
D11  (via drill 0.35)
  Top 0.152: U1.82 41.86,21.14 arc90 v41.7,21.3 | v8.7,22.2 8.7,22.15 arc90 U3.12
  Bottom 0.152: v41.7,21.3 9.6,21.3 arc-90 v8.7,22.2
DATA0  (via drill 0.35)
  Top 0.152: U2.5 26.62,33.22 arc90 26.1,32.7 26.1,20.3 arc90 29.6,16.8 37.19,16.8 arc-90 v39.09,14.9 | v40.6,8.1 40.6,3.2 arc90 U$6.P$15
  Bottom 0.152: v39.09,14.9 39.09,9.61 arc90 v40.6,8.1
DATA1  (via drill 0.35)
  Top 0.152: U$6.P$16 arc-90 37.6,7.45 v37.6,11.2 | v37.4,14.01 arc90 35.41,16 29.2,16 arc-90 25,20.2 25,32.94 arc-90 26.58,34.52 U2.3
  Bottom 0.152: v37.6,11.2 arc-90 37.4,11.4 v37.4,14.01
GND  (via drill 0.35)
  Top 0.152: U3.15 11.7,20 U3.TAB | U3.5 13.2,19.5 U3.TAB | U3.43 14.4,21 12.7,19.3 U3.TAB | U3.35 14.7,17 U3.TAB | U3.23 10.2,16.5 U3.TAB
  other vias: 47.1,8.3 50.1,8.3 54.2,8.2 30.8,5.6 30.8,3.3 27.9,24.5 28.1,19.3 26.1,10 31.2,10.1 48.9,42 47.3,37.4 43.3,33.8 49.9,33.1 50.8,30.1
  pour Top: 0,0 0,55.7 1.2,55.7 78.6,55.7 78.6,52.3 78.6,0 77.2,0
  pour Bottom: 0,0 0,55.7 2,55.7 78.6,55.7 78.6,51.8 78.6,0 74.8,0
GREEN  (via drill 0.35)
  Top 0.152: R24.1 R23.1 R25.1 R26.1 R28.1 R27.1 72.65,42.5 69.9,42.5 v69.2,41.8 | J1.2 33.31,44.51 arc-90 34.2,45.4 41.3,45.4 arc-90 42.2,44.5 42.2,44.3 arc90 42.7,43.8 53.1,43.8 arc-90 v55.1,41.8
  Bottom 0.152: v55.1,41.8 v69.2,41.8
GREEN0
  Top 0.152: U1.13 56.23,27.57 arc-90 56.6,27.2 65.4,27.2 arc90 70.3,32.1 arc-109 R23.2
GREEN1
  Top 0.152: U1.12 56.13,27.07 arc-90 56.4,26.8 67.55,26.8 arc90 R24.2
GREEN2
  Top 0.152: U1.15 56.17,28.57 arc90 56.4,28.8 56.4,29 arc-90 56.6,29.2 67.2,29.2 arc90 69.5,31.5 69.5,32.95 arc-90 R25.2
GREEN3
  Top 0.152: U1.16 55.77,29.07 arc90 56,29.3 arc-90 56.3,29.6 67.2,29.6 arc90 69.1,31.5 69.1,34.65 arc-90 R26.2
GREEN4
  Top 0.152: U1.19 67.37,30.57 arc90 68.2,31.4 68.2,37.95 arc-90 R27.2
GREEN5
  Top 0.152: U1.18 67.37,30.07 arc90 68.6,31.3 68.6,36.25 arc-90 R28.2
HS
  Top 0.152: U1.99 50.36,16.98 arc90 R4.2
L_AUDIO  (via drill 0.35)
  Top 0.152: LEFT_AUDIO.TP 62.2,52.8 arc-90 65.1,49.9 65.1,48.01 arc-90 v64.89,47.8
  Bottom 0.152: v64.89,47.8 63.38,47.8 arc90 J4.4
MISO
  Top 0.152: U3.11 10.2,22.6 arc90 6.5,26.3 6.4,26.3 arc-90 6.1,26.6 6.1,28.3 arc90 5.6,28.8 5.2,28.8 arc-90 4.6,29.4 arc90 4,30 3.59,30 arc-90 SV2.1
MOSI  (via drill 0.35)
  Top 0.152: v10.3,25 arc-90 10.7,24.6 U3.10
  Bottom 0.152: SV2.4 6.03,32.87 arc-90 7,31.9 7,28.3 arc90 v10.3,25
N$1
  Top 0.152: U3.17 5.5,19 arc-90 Y1.3 4.75,17.3 arc90 C15.1
N$2
  Top 0.152: R1.2 arc90 48.4,13.82 48.4,11.1 arc-90 48.02,10.72 U$1.3
N$3
  Top 0.152: C22.1 arc90 2.45,25.7 Y1.1 arc90 4.4,21.5 5.4,21.5 arc-90 6,20.9 arc90 7.4,19.5 U3.16
N$4
  Top 0.152: U3.6 12.7,25.75 arc-90 C24.1
N$6  (via drill 0.35)
  Top 0.152: R3.1 54.59,14.49 arc90 v54.7,14.6 | v64.1,50.4 29.88,50.4 arc90 J1.14
  Bottom 0.152: v64.1,50.4 arc-90 65.5,49 65.5,44.9 arc90 67.8,42.6 72.9,42.6 arc-90 74.7,40.8 74.7,25.4 arc-90 59.9,10.6 55.2,10.6 54.7,11.1 v54.7,14.6
N$7
  Top 0.152: D1.1 36.47,20.85 arc90 U1.75
N$8  (via drill 0.35)
  Top 0.152: U$5.1 24.3,41.8 arc90 25.4,40.7 v33.3,40.7 35.35,40.7 arc-90 R11.1 | v38.5,41.49 39.34,40.65 R12.2
  Bottom 0.152: v33.3,40.7 37.71,40.7 v38.5,41.49
N$9  (via drill 0.35)
  Top 0.152: R4.1 51.15,13.95 arc90 v52.1,13
  Bottom 0.152: J1.13 arc90 32.29,48 41.3,48 arc90 42,48.7 42,49 arc-90 42.8,49.8 44.6,49.8 arc-90 45.3,49.1 arc90 46.1,48.3 55.1,48.3 arc90 55.5,48.7 55.5,49 arc-90 56.7,50.2 62.4,50.2 arc-90 63.6,51.4 64,51.4 arc-90 65.9,49.5 65.9,45.1 arc90 68,43 73.4,43 arc-90 75.8,40.6 75.8,22.4 arc-90 63.4,10 53,10 52.1,10.9 v52.1,13
N$15  (via drill 0.35)
  Top 0.152: U$5.7 v23.04,38.97 arc90 22.4,39.6 22.3,39.6 arc-90 21.8,40.1 21.8,43.22 arc90 U$5.3 | R15.2 52,41.3 arc90 50.6,42.7 27.79,42.7 arc90 v26.4,41.31
  Bottom 0.152: v26.4,41.31 25.38,41.31 arc90 v23.04,38.97
OSC_OUT
  Top 0.152: U1.97 49.36,16.48 arc-90 R1.1
R_AUDIO  (via drill 0.35)
  Top 0.152: RIGHT_AUDIO.TP 50.3,52.9 arc90 v49.5,52.1
  Bottom 0.152: v49.5,52.1 51.33,52.1 arc-90 J4.1
RED  (via drill 0.35)
  Top 0.152: R14.1 R16.1 R17.1 R18.1 R19.1 73.55,28.45 arc90 v73.5,28.5
  Bottom 0.152: v73.5,28.5 73.5,36.1 arc90 69.4,40.2 45.4,40.2 arc-90 42.8,42.8 42.8,42.9 arc90 41.5,44.2 35.62,44.2 arc90 J1.1
RED0
  Top 0.152: U1.1 arc90 56.4,17.7 64.6,17.7 arc-90 66.4,15.9 66.4,14.1 arc90 68.5,12 R14.2
RED1
  Top 0.152: R16.2 67.3,14.1 arc-90 66.9,14.5 66.9,15.4 arc90 64,18.3 56.8,18.3 arc-90 54.1,21 54.1,21.5 arc90 53.6,22 52.6,22 arc-90 U1.2
RED2
  Top 0.152: R17.2 68,16.2 arc-90 66.8,17.4 arc90 65.5,18.7 57.2,18.7 arc-90 54.7,21.2 54.7,21.8 arc90 53.9,22.6 52.56,22.6 arc90 U1.3
RED3
  Top 0.152: R18.2 arc90 70.95,19.2 56.9,19.2 arc-90 55.2,20.9 55.2,21.6 arc90 53.7,23.1 52.56,23.1 arc90 U1.4
RED4
  Top 0.152: U1.7 56.07,24.57 arc90 56.2,24.7 56.2,24.9 arc-90 56.3,25 67.25,25 arc-90 R19.2
RESET  (via drill 0.35)
  Top 0.152: U3.13 9.2,21 arc-90 7.9,22.3 v7.9,23.6 | v7.9,23.6 7.9,23.7 | 7.9,23.7 7.9,24.7 arc90 6.8,25.8 4.85,25.8 arc-90 R5.2 | 7.9,23.7 v7.9,23.6
  Bottom 0.152: v7.9,23.6 10.5,23.6 arc90 11,24.1 11,29.6 arc90 10.4,30.2 8.47,30.2 arc-90 SV2.5
SCK
  Top 0.152: U3.9 11.2,24.8 arc90 9.7,26.3 9.3,26.3 arc-90 6.4,29.2 6.4,29.73 arc90 SV2.3
SCK_PROG  (via drill 0.35)
  Top 0.152: U1.48 39.86,37.79 arc-90 v39.97,37.9 | v21.8,38.5 21.8,36.78 arc-90 U$5.6
  Bottom 0.152: v39.97,37.9 22.4,37.9 arc-90 v21.8,38.5 11.7,38.5 arc-90 10.43,39.77 SV1.3
SDI_PROG  (via drill 0.35)
  Top 0.152: v39.9,42 arc-90 40.76,41.14 40.76,37.6 40.86,37.5 40.86,35.34 U1.46 | v23.1,41.8 23.1,43.19 arc90 U$5.2 | SV1.4 19.4,39.8 arc90 v21.1,41.5
  Bottom 0.152: v21.1,41.5 22.8,41.5 arc90 v23.1,41.8 arc-90 23.4,42.1 39.8,42.1 v39.9,42
SDO_PROG  (via drill 0.35)
  Top 0.152: U1.45 41.36,33.96 arc-90 v41.3,33.9 | v20.5,35.1 U$5.5 arc90 U$5.5
  Bottom 0.152: v41.3,33.9 21.7,33.9 arc-90 v20.5,35.1 10.3,35.1 arc-90 9.2,36.2 9.2,41.4 arc-90 10.14,42.34 SV1.1
SS_PROG
  Top 0.152: U1.49 39.36,38.71 arc-90 R12.1
VS
  Top 0.152: U1.100 arc-90 53.27,17.49 R3.2
VYSNC  (via drill 0.35)
  Top 0.152: U2.4 26.55,33.85 arc90 25.7,33 25.7,20.2 arc90 29.5,16.4 36.31,16.4 arc-90 v38.49,14.22 | v38.4,11.8 arc90 41.3,8.9 43.6,8.9 arc-90 44.5,8 44.5,5.65 arc-90 U$6.P$12
  Bottom 0.152: v38.49,14.22 38.49,11.89 arc-90 v38.4,11.8

### Text on the board
tPlace: C14 | C17
bPlace: Right Audio | Left Audio | NES Controller Port